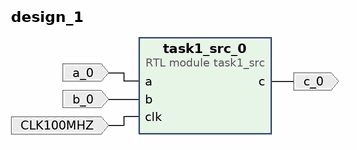
[diagram p0: block diagram of the top level]
# Vivado block design design_1, xc7a100tcsg324-3, Vivado 2018.2
create_bd_design design_1

create_bd_port -dir I a_0
create_bd_port -dir I b_0
create_bd_port -dir O c_0
create_bd_port -dir I -type clk CLK100MHZ

create_bd_cell -type module -reference task1_src task1_src_0

# ---- connections ----

connect_bd_net -net a_0_1 [get_bd_ports a_0] [get_bd_pins task1_src_0/a]
connect_bd_net -net b_0_1 [get_bd_ports b_0] [get_bd_pins task1_src_0/b]
connect_bd_net [get_bd_pins task1_src_0/c] [get_bd_ports c_0]
connect_bd_net -net clk_0_1 [get_bd_ports CLK100MHZ] [get_bd_pins task1_src_0/clk]

validate_bd_design
save_bd_design
